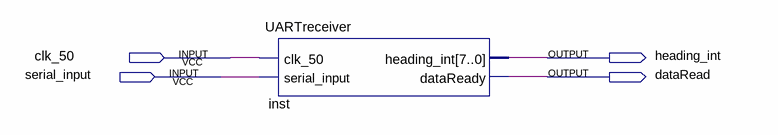
[diagram p0: schematic sheet]
// Quartus schematic UARTreceiver1.bdf as structural Verilog: 1 symbols, 4 pins
module UARTreceiver1 (
  input  clk_50,
  input  serial_input,
  output heading_int,
  output dataRead
);

  UARTreceiver inst (.clk_50(clk_50), .serial_input(serial_input), .heading_int(heading_int), .dataReady(dataRead));
endmodule
